# Altium project Water Heater Chip.PrjPcb
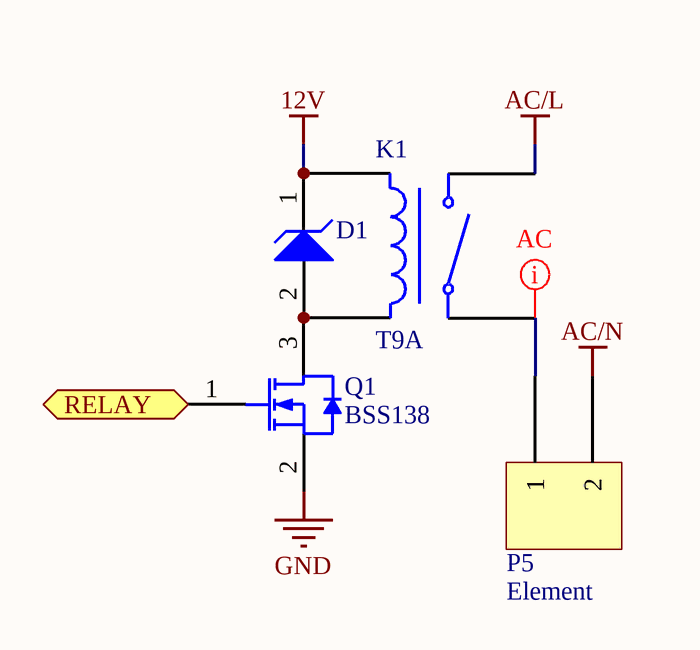
[diagram p0: Relay.SchDoc]
2 sheets, 6 parts. Net scope: flat (ports and power ports of the same name join across sheets).
Board file: PCB.PcbDoc
Sheets:
  Relay.SchDoc
  CEA2045.SchDoc

## Sheet Relay.SchDoc
size A

### Parts
(Parts that share a designator on the sheet are numbered #1, #2 ... from top to bottom, then left to right.)
D1  SMF18AT1G  [ONSC-SOD-123FL-2-498_V]  (value not drawn)
K1  T9A  [PCBComponent_1 - duplicate]
P5#1  Element  [PCBComponent_1]
Q1  BSS138  [FAIR-SOT23-3_V]

### Ports
RELAY (in)

### Nets
12V: D1.1(K) K1.COIL_B
AC/L: K1.LOAD
AC/N: P5#1.2
GND: Q1.2(S)
NetD1_2: D1.2(A) K1.COIL_A Q1.3(D)
NetK1_COM: K1.COM P5#1.1
NetQ1_1: Q1.1(G) ; port RELAY

### Layout directives
net class AC: NetK1_COM

### Library data of the parts
D1 = CMP-1061-00605-1: 200 W Transient Voltage Suppressor, 2-Pin SOD-123FL, Pb-Free, Tape and Reel; Manufacturer: On Semiconductor; Direction: Unidirectional; IR Max (uA): 1; V(BR) Typ (V): 21; ComponentLink3Description: Package Specification; ComponentLink1URL: http://www.onsemi.com/; PartNumber: SMF18AT1G; ComponentLink3URL: http://www.onsemi.com/pub_link/Collateral/498-01.PDF; PackageDescription: 2-Pin SOD, Body 1.65 x 2.7 mm; Mounting Technology: Surface Mount; ComponentLink1Description: Manufacturer URL; DatasheetVersion: Rev. 7; ComponentLink2URL: http://www.onsemi.com/pub_link/Collateral/SMF5.0AT1-D.PDF; ComponentLink2Description: Datasheet; PackageVersion: Rev. D, 05/2013; PackageReference: SOD-123FL-2-498; Packing: Tape and Reel; RoHS: Pb-Free
P5#1 = EUROSTYLE 6 35 MM FIXED 2 CIR
Q1 = CMP-1670-00009-1: N-Channel Logic Level Enhancement Mode Field Effect Transistor, 220 mA, 50 V, -55 to 150 degC, 3-Pin SOT-23, RoHS, Tape and Reel; ESR: 40 Ohm; Tolerance: 30ppm; Capacitance: 1.8E-11 f; Load Capacitance: 18 pF; Frequency: 12 MHz; Resistance: 100 Ohm; Min Operating Temperature: -20degC; ComponentLink2URL: https://www.fairchildsemi.com/datasheets/BS/BSS138.pdf; Max Operating Temperature: 70degC; Width: 0.126 inch; Pins: 4; Length: 0.197 inch; ComponentLink2Description: Datasheet; Package Quantity: 1; PackageReference: SOT23-3; Packaging: Tape and Reel; RoHSCompliant: True; Frequency Tolerance: 30ppm; ComponentLink3Description: Package Specification; Mount: Surface Mount; REACH SVHC: Unknown; Height: 0.041 inch; ComponentLink1URL: https://www.fairchildsemi.com/; PackageDescription: 3-Pin Small Outline Transistor, Body 2.92 x 1.325 mm, Pitch 0.95 mm; ComponentLink3URL: http://www.fairchildsemi.com/dwg/MA/MA03D.pdf; ComponentLink1Description: Manufacturer URL; DatasheetVersion: Rev. C, 10/2005

## Sheet CEA2045.SchDoc
size A
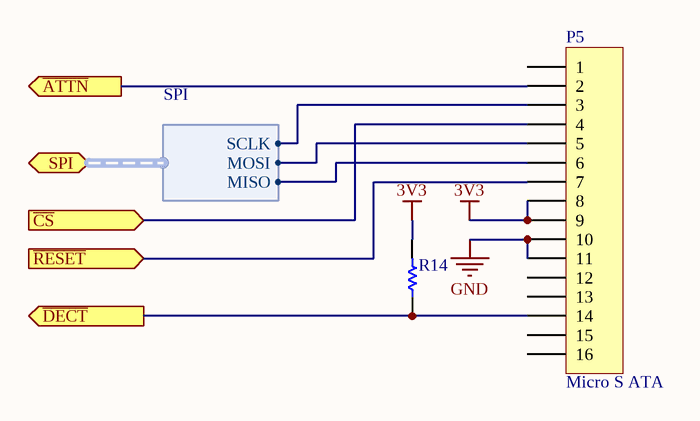
[diagram p1: CEA2045.SchDoc]

### Parts
(Parts that share a designator on the sheet are numbered #1, #2 ... from top to bottom, then left to right.)
P5#2  Micro S ATA  [HDR1X16]
R14  1K 5% 0603(1608)  [RESC0603(1608)_L]  (value not drawn)

### Ports
SPI (harness SPI), ~{ATTN} (out), ~{CS} (in), ~{DECT} (out), ~{RESET} (in)

### Harnesses
SPI: MISO, MOSI, SCLK

### Nets
3V3: P5#2.8 P5#2.9 R14.2
GND: P5#2.10 P5#2.11
NetP5#2_2: P5#2.2 ; port ~{ATTN}
NetP5#2_3: P5#2.3 ; port SPI.SCLK
NetP5#2_4: P5#2.4 ; port ~{CS}
NetP5#2_5: P5#2.5 ; port SPI.MOSI
NetP5#2_6: P5#2.6 ; port SPI.MISO
NetP5#2_7: P5#2.7 ; port ~{RESET}
NetP5#2_14: P5#2.14 R14.1 ; port ~{DECT}

Not connected (* = marked no-connect by the designer): P5#2 1 12 13 15 16

### Library data of the parts
P5#2 = Header 16: Header, 16-Pin; LatestRevisionDate: 17-Jul-2002; LatestRevisionNote: Re-released for DXP Platform.; Publisher: Altium Limited
R14 = CMP-1012-00074-1: 1K 0.1W 5% 0603 (1608 Metric)  SMD; Case-Metric: 1608; Value: 1000.00 Ohm; Case-EIA: 0603; Power: 0.1 W; Tolerance: 5 %; Technology: SMT

## Nets that join several sheets
GND: Relay (Q1.2), CEA2045 (P5#2.10 P5#2.11)